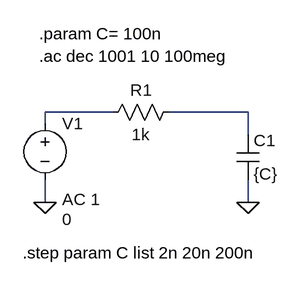
[diagram p0: schematic ParamCircuit.asc]
ParamCircuit.asc, the LTspice schematic file:
Version 4
SHEET 1 880 680
WIRE 176 128 80 128
WIRE 368 128 256 128
WIRE 80 144 80 128
WIRE 368 160 368 128
WIRE 80 256 80 224
WIRE 368 256 368 224
FLAG 80 256 0
FLAG 368 256 0
SYMBOL cap 352 160 R0
SYMATTR InstName C1
SYMATTR Value {C}
SYMBOL res 272 112 R90
WINDOW 0 0 56 VBottom 2
WINDOW 3 32 56 VTop 2
SYMATTR InstName R1
SYMATTR Value 1k
SYMBOL voltage 80 128 R0
WINDOW 3 24 152 Left 2
WINDOW 123 24 124 Left 2
WINDOW 39 0 0 Left 0
SYMATTR InstName V1
SYMATTR Value 0
SYMATTR Value2 AC 1
TEXT 72 48 Left 2 !.ac dec 1001 10 100meg
TEXT 72 16 Left 2 !.param C= 100n
TEXT 48 328 Left 2 !.step param C list 2n 20n 200n

The netlist it stands for:
* ParamCircuit.asc
C1 N002 0 {C}
R1 N002 N001 1k
V1 N001 0 0 AC 1
.ac dec 1001 10 100meg
.param C= 100n
.step param C list 2n 20n 200n
.backanno
.end